# EasyEDA Pro project MSDR_EzEdaPro.eprj, schematic Schematic1_1
Create Date: 2024-09-13; Page Name: P1; Project Name: MSDR_EzEdaPro; Schematic Name: Schematic1_1; Update Date: 2024-09-13; Company: EasyEDA.com; Drawn: EasyEDA; Page Size: A4; Part Number: JLCPCB-002; Reviewed: EasyEDA; Version: V0.1
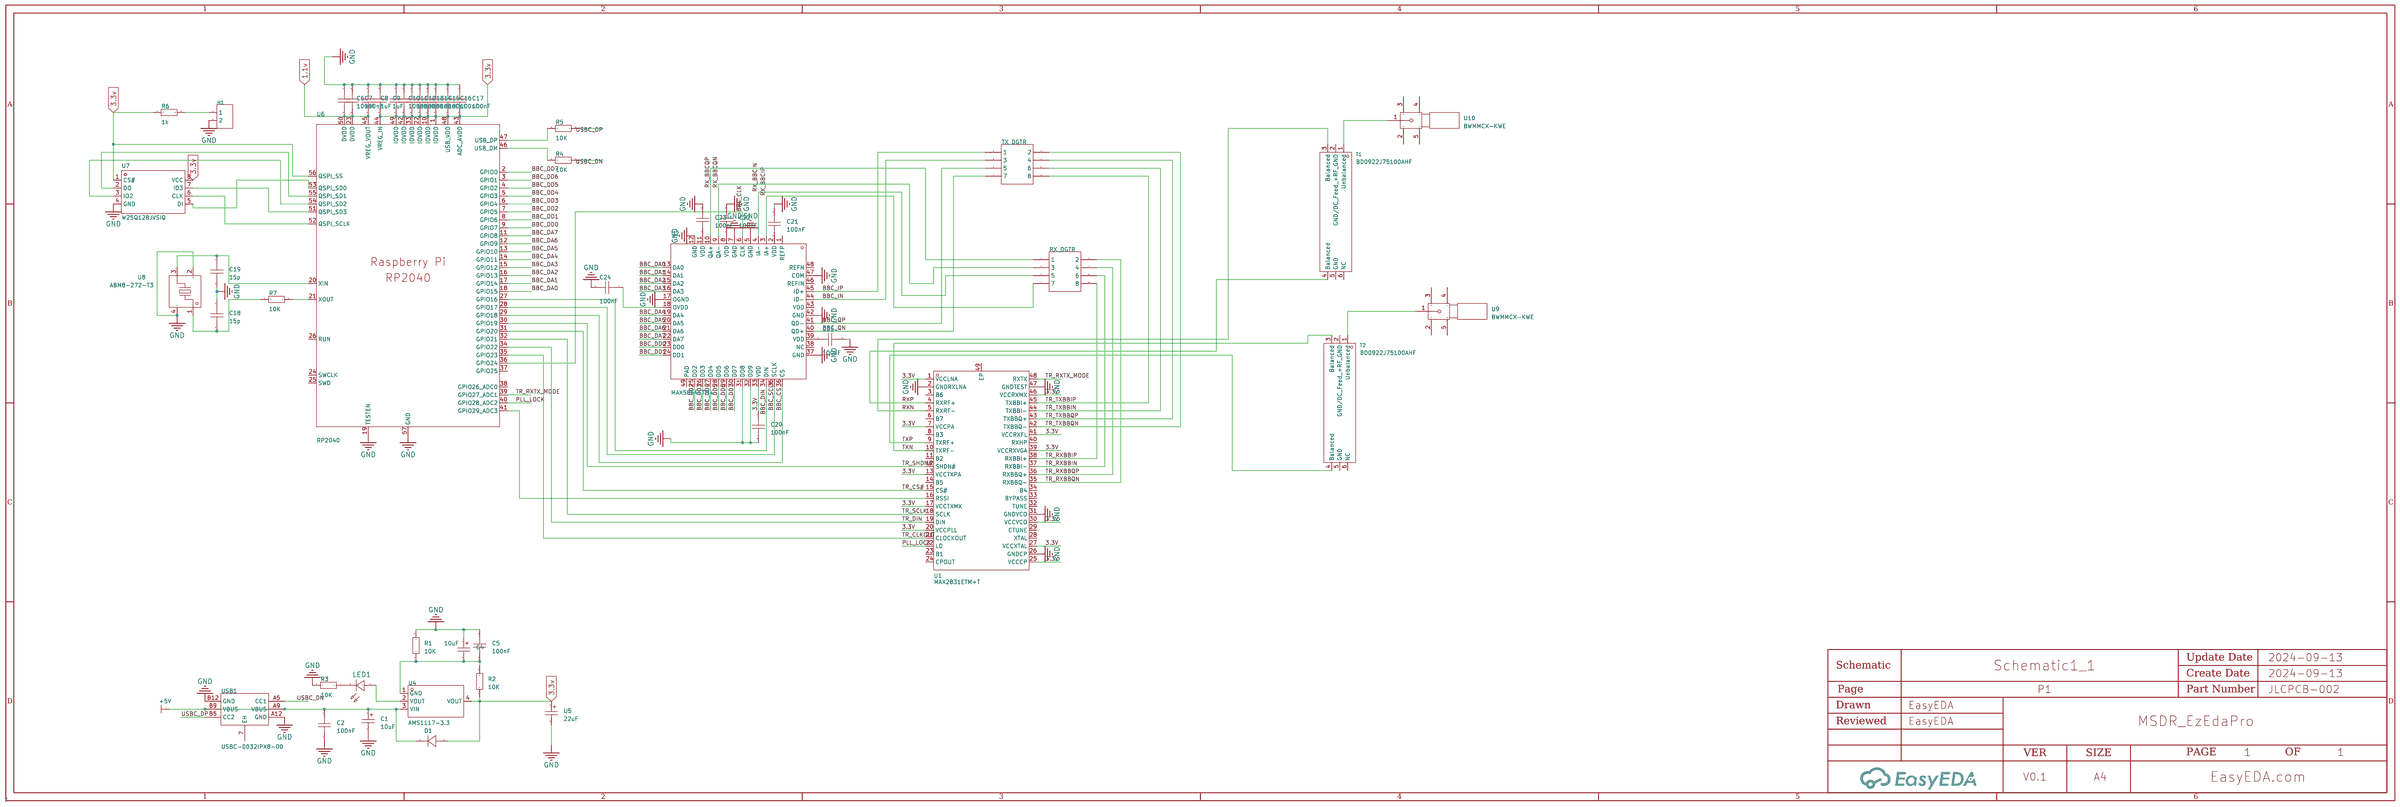
[diagram p0: schematic sheet]

## Parts
C1  10uF  [CAP-SMD_BD3.0-L3.3-W3.3-RD]
C2  100nF  [C0805]
C4  10uF  [CAP-SMD_BD3.0-L3.3-W3.3-RD]
C5  100nF  [C0805]
C6  100nF  [C0402]
C7  100nF  [C0402]
C8  1uF  [C0402]
C9  1uF  [C0402]
C10  100nF  [C0402]
C11  100nF  [C0402]
C12  100nF  [C0402]
C13  100nF  [C0402]
C14  100nF  [C0402]
C15  100nF  [C0402]
C16  100nF  [C0402]
C17  100nF  [C0402]
C18  15p  [C0402]
C19  15p  [C0402]
C20  100nF  [C0201]
C21  100nF  [C0201]
C22  100nF  [C0201]
C23  100nF  [C0201]
C24  100nF  [C0201]
C25  100nF  [C0201]
D1  -  [SMA_L4.4-W2.8-LS5.4-RD]
H1  -  [HDR-TH_2P-P2.54-V-F]
LED1  -  [LED0805-RD_GREEN]
R1  10K  [R0603]
R2  10K  [R0603]
R3  10K  [R0603]
R4  10K  [R0402]
R5  10K  [R0402]
R6  1k  [R0402]
R7  10K  [R0402]
RX_DGTR  -  [HDR-TH_8P-P2.54-V-F-R2-C4-S2.54-1]
T1  BD0922J75100AHF  [XFMR-SMD_6P-L2.1-W1.3-P0.65-BL]
T2  BD0922J75100AHF  [XFMR-SMD_6P-L2.1-W1.3-P0.65-BL]
TX_DGTR  -  [HDR-TH_8P-P2.54-V-F-R2-C4-S2.54-1]
U1  MAX2831ETM+T  [TQFN-48_L7.0-W7.0-P0.50-TL-EP5.6]
U2  MAX5864ETM+  [QFN-48_L7.0-W7.0-P0.50-BL-EP5.1]
U4  AMS1117-3.3  [SOT-223-3_L6.5-W3.4-P2.30-LS7.0-BR]
U5  22uF  [CASE-B_3528]
U6  RP2040  [LQFN-56_L7.0-W7.0-P0.4-EP]
U7  W25Q128JVSIQ  [SOIC-8_L5.3-W5.3-P1.27-LS8.0-BL]
U8  ABM8-272-T3  [CRYSTAL-SMD_4P-L3.2-W2.5-BL]
U9  BWMMCX-KWE  [MMCX-TH_DL-MMCX-KWE]
U10  BWMMCX-KWE  [MMCX-TH_DL-MMCX-KWE]
USB1  USBC-0032IPX8-00  [TYPE-C-USB-SMD_USBC-0032IPX8-00]

## Library data of the parts
C1 C4 = C_Ele_SMD_3x5.4mm: Supplier Footprint: SMD,3x5.4mm
C2 C5 = CAP_0805: Supplier Footprint: 0805
C6-C19 = CAP_0402: Supplier Part: C1525; Supplier Footprint: 0402
C20-C25 = CAP_0201: Supplier Footprint: 0201
D1 = 1N4007: Supplier Footprint: SMA(DO-214AC); Supplier Part: C727081
H1 = HDR-F_2.54_1x2P: Supplier Footprint: Through
LED1 = LED_0805-R: Supplier Footprint: 0805
R1-R3 = Res_0603: Supplier Footprint: 0603
R4-R7 = Res_0402: Supplier Footprint: 0402
RX_DGTR TX_DGTR = HDR-F-2.54_2x4: Supplier Footprint: Through
T1 T2 = BD0922J75100AHF: Frequency Range:900MHz~2.2GHz Frequency Range:900MHz~2.2GHz Impedance Ratio-Unbalanced/Balanced:75Ω:100Ω Insertion Loss (Max):1.3dB Phase Balance:4° Return Loss (Min):12dB; Supplier Part: C502733; Manufacturer: Anaren(安伦); Supplier Footprint: 0805; JLCPCB Part Class: Extended Part; Datasheet: https://atta.szlcsc.com/upload/public/pdf/source/20200325/C502733_A6A72FA540C229E36F661D21F2A3F54B.pdf; Supplier: LCSC; Frequency Range: 900MHz~2.2GHz; Impedance Ratio-Unbalanced/Balanced: 75Ω:100Ω; Insertion Loss (Max): 1.3dB; Phase Balance: 4°; Return Loss (Min): 12dB
U1 = MAX2831ETM+T: Frequency Range:2.4GHz Frequency Range:2.4GHz Interface:SPI Operating Voltage:2.7V~3.6V Operating Voltage:2.7V~3.6V Applications:WiFi Output Power:21dBm Data Rate:54Mbps Current Of Transmitting:82mA Sensitivity:-76dBm Receive Current:62mA Operating Temper; Supplier Part: C2152047; Manufacturer: ADI(亚德诺)/MAXIM(美信); Supplier Footprint: TQFN-48-EP(7x7); JLCPCB Part Class: Extended Part; Datasheet: https://atta.szlcsc.com/upload/public/pdf/source/20210601/D5E13A4F591163B65DE03F91E5182685.pdf; Supplier: LCSC; Frequency Range: 2.4GHz; Interface: SPI; Operating Voltage: 2.7V~3.6V; Applications: WiFi; Output Power: 21dBm; Data Rate: 54Mbps; Current Of Transmitting: 82mA; Sensitivity: -76dBm; Receive Current: 62mA; Operating Temperature: -40℃~+85℃
U2 = MAX5864ETM+: Supply Voltage:2.7V~3.3V Supply Voltage:2.7V~3.3V; LCSC Part Name: MAX5864ETM; Supplier Part: C143525; Manufacturer: ADI(亚德诺)/MAXIM(美信); Supplier Footprint: QFN-48-EP(7x7); JLCPCB Part Class: Extended Part; Datasheet: https://atta.szlcsc.com/upload/public/pdf/source/20171204/C143525_15123772477351162683.pdf; Supplier: LCSC; Supply Voltage: 2.7V~3.3V
U4 = AMS1117-3.3_C6186: Output Type: Maximum Input Voltage:- Output Voltage:3.3V Output Voltage:3.3V MAX Output Current:1A Power Supply Rejection Ratio (PSRR):72dB@(120Hz) Dropout Voltage:1.3V@(800mA) standby current:- Noise:- Feature:- Operating Temperature:- Operating Temperat; LCSC Part Name: 输出3.3V 1A; Supplier Part: C6186; Manufacturer: AMS; Supplier Footprint: SOT-223; JLCPCB Part Class: Basic Part; Datasheet: https://atta.szlcsc.com/upload/public/pdf/source/20180727/C6186_7A095716F0823C02F1997A905E26C086.pdf; Supplier: LCSC; Output Voltage: 3.3V; MAX Output Current: 1A; Power Supply Rejection Ratio (PSRR): 72dB@(120Hz); Dropout Voltage: 1.3V@(800mA); Output Polarity: Positive electrode; Number of Outputs: 1
U5 = CA45-B-20V-22UF-M: Capacitance: Tolerance:±20% Tolerance:±20% Rated Voltage: Leakage Current(DCL):- Ripple Current:- Equivalent Series Resistance(ESR):-; LCSC Part Name: 22uF ±20% 20V; Supplier Part: C2837196; Manufacturer: CEC(振华新云); Supplier Footprint: CASE-B-3528; JLCPCB Part Class: Extended Part; Datasheet: https://atta.szlcsc.com/upload/public/pdf/source/20210531/C2837196_DDCE34066E9DA6377CD15749F6AD58AB.pdf; Supplier: LCSC; Tolerance: ±20%
U6 = RP2040_C2040: CPU Core:- RAM Size:264KB GPIO Ports Number:30 Operating Voltage Range:- Operating Voltage Range:- CPU Maximum Speed:133MHz Program Memory Type:- Operating Temperature Range:- Operating Temperature Range:- ADC (Bit):12bit DAC (Bit):- PWM (Bit):- 8Bit Time; LCSC Part Name: RP2040（RP2B2）; Supplier Part: C2040; Manufacturer: Raspberry Pi(树莓派); Supplier Footprint: LQFN-56(7x7); JLCPCB Part Class: Extended Part; Datasheet: https://atta.szlcsc.com/upload/public/pdf/source/20210621/C2040_96F425825606B7957D87DD32E2512CA9.pdf; Supplier: LCSC; RAM Size: 264KB; GPIO Ports Number: 30; CPU Maximum Speed: 133MHz; ADC (Bit): 12bit; UART/USART: 2; I2C: 2; SPI: 2; Universal Serial Bus: 有; Peripheral/Function: DMA；PWM; Direct Memory Access: 有
U7 = W25Q128JVSIQ: Interface Type:- Memory Size:128Mbit Clock Frequency (fc):- Supply Voltage:- Supply Voltage:- Supply Current (Read):- Supply Current (Program):- Supply Current (Erase):- Standby supply current:- Page Programming Time (Tpp):- Block Erase Time (tBE):- Data; LCSC Part Name: W25Q128JVSIQ 编带; Supplier Part: C97521; Manufacturer: WINBOND(华邦); Supplier Footprint: SOIC-8-208mil; JLCPCB Part Class: Basic Part; Datasheet: https://atta.szlcsc.com/upload/public/pdf/source/20170316/1489627409956.pdf; Supplier: LCSC; Memory Size: 128Mbit
U8 = ABM8-272-T3_C20625731: Supplier Part: C20625731; Manufacturer: ABRACON; Supplier Footprint: SMD3225-4P; JLCPCB Part Class: Extended Part; Datasheet: https://atta.szlcsc.com/upload/public/pdf/source/20240227/A8BE43F636D80F75C9AF5C59EDF21E9A.pdf; Supplier: LCSC
U9 U10 = BWMMCX-KWE: Connector Type:板端 Interface Type:内孔 Number of Ports:1 Interface Diameter:3.45mm Interface Length/Height:6.8mm Frequency-Max:6GHz RF Series:- Impedance:50Ω Style:弯头 Contact Material:- Contact Plating:- Operating Temperature Range:- Operating Temperature Ra; LCSC Part Name: 内孔 弯头; Supplier Part: C5137199; Manufacturer: BAT WIRELESS(蝙蝠无线); Supplier Footprint: 插件; JLCPCB Part Class: Extended Part; Datasheet: https://atta.szlcsc.com/upload/public/pdf/source/20230721/A5C4EBF049B4E6F2F5E4EE0CA658130D.pdf; Supplier: LCSC; Connector Type: 板端; Interface Type: 内孔; Number of Ports: 1; Interface Diameter: 3.45mm; Interface Length/Height: 6.8mm; Frequency-Max: 6GHz; Impedance: 50Ω; Style: 弯头
USB1 = USBC-0032IPX8-00: Connector Type:Type-C Standard:USB 3.1 Gender:Female Mounting Style:Horizontal attachment Number of Contacts:6P Number of Ports:1 Current Rating - Power (Max):3A Operating Temperature Range:-30℃~+85℃ Operating Temperature Range:-30℃~+85℃ Connect-Disconnec; LCSC Part Name: Type-C 母 卧贴 两件套; Supplier Part: C783299; Manufacturer: SHOU HAN(首韩); Supplier Footprint: SMD; JLCPCB Part Class: Extended Part; Datasheet: https://atta.szlcsc.com/upload/public/pdf/source/20200915/C783299_CEA99EAD24A7AFC4E6DA6639D9ED2813.pdf; Supplier: LCSC; Connector Type: Type-C; Standard: USB 3.1; Gender: Female; Mounting Style: Horizontal attachment; Number of Contacts: 6P; Number of Ports: 1; Current Rating - Power (Max): 3A; Operating Temperature Range: -30℃~+85℃; Connect-Disconnect Life: 10,000 times; Core Colour: Black

## Nets
1.1v: C6.2 C7.2 C8.2 U6.23(DVDD) U6.45(VREG_VOUT) U6.50(DVDD)
3.3V: C20.1 U1.1(VCCLNA) U1.7(VCCPA) U1.13(VCCTXPA) U1.17(VCCTXMX) U1.20(VCCPLL) U1.25(VCCCP) U1.27(VCCXTAL) U1.30(VCCVCO) U1.39(VCCRXVGA) U1.41(VCCRXFL) U1.46(VCCRXMX) U2.33(VDD)
3.3v: C9.2 C10.2 C11.2 C12.2 C13.2 C14.2 C15.2 C16.2 C17.2 D1.2(A) R2.1 R6.1 U4.4(VOUT) U5.1 U6.1(IOVDD) U6.10(IOVDD) U6.22(IOVDD) U6.33(IOVDD) U6.42(IOVDD) U6.43(ADC_AVDD) U6.44(VREG_IN) U6.48(USB_VDD) U6.49(IOVDD) U6.56(QSPI_SS) U7.1(CS#) U7.8(VCC)
+5V: C1.1 C2.1 D1.1(K) U4.3(VIN) USB1.A9(VBUS) USB1.B9(VBUS)
GND: C1.2 C2.2 C4.1 C5.1 C6.1 C7.1 C8.1 C9.1 C10.1 C11.1 C12.1 C13.1 C14.1 C15.1 C16.1 C17.1 C18.1 C19.2 C20.2 C21.2 C22.2 C23.2 C24.2 C25.2 H1.2 R1.2 R3.2 U1.2(GNDRXLNA) U1.26(GNDCP) U1.31(GNDVCO) U1.47(GNDTEST) U2.5(GND) U2.7(GND) U2.12(GND) U2.17(OGND) U2.31(DD8) U2.32(DD9) U2.37(GND) U2.42(GND) U2.47(COM) U5.2 U6.19(TESTEN) U6.57(GND) U7.4(GND) U8.2(GND) U8.4(GND) USB1.A12(GND) USB1.B12(GND)
BBC_CLK: U2.6(CLK) U6.36(GPIO24)
BBC_CS: U2.36(CS) U6.29(GPIO18)
BBC_DA0: U2.13(DA0) U6.18(GPIO15)
BBC_DA1: U2.14(DA1) U6.17(GPIO14)
BBC_DA2: U2.15(DA2) U6.16(GPIO13)
BBC_DA3: U2.16(DA3) U6.15(GPIO12)
BBC_DA4: U2.19(DA4) U6.14(GPIO11)
BBC_DA5: U2.20(DA5) U6.13(GPIO10)
BBC_DA6: U2.21(DA6) U6.12(GPIO9)
BBC_DA7: U2.22(DA7) U6.11(GPIO8)
BBC_DD0: U2.23(DD0) U6.9(GPIO7)
BBC_DD1: U2.24(DD1) U6.8(GPIO6)
BBC_DD2: U2.25(DD2) U6.7(GPIO5)
BBC_DD3: U2.26(DD3) U6.6(GPIO4)
BBC_DD4: U2.27(DD4) U6.5(GPIO3)
BBC_DD5: U2.28(DD5) U6.4(GPIO2)
BBC_DD6: U2.29(DD6) U6.3(GPIO1)
BBC_DD7: U2.30(DD7) U6.2(GPIO0)
BBC_DIN: U2.34(DIN) U6.27(GPIO16)
BBC_IN: TX_DGTR.3 U2.44(ID-)
BBC_IP: TX_DGTR.1 U2.45(ID+)
BBC_QN: TX_DGTR.7 U2.40(QD+)
BBC_QP: TX_DGTR.5 U2.41(QD-)
BBC_SCLK: U2.35(SCLK) U6.28(GPIO17)
PLL_LOCK: U1.22(LD) U6.40(GPIO28_ADC2)
RX_BBCIN: RX_DGTR.5 U2.4(IA-)
RX_BBCIP: RX_DGTR.7 U2.3(IA+)
RX_BBCQN: RX_DGTR.3 U2.9(QA-)
RX_BBCQP: RX_DGTR.1 U2.10(QA+)
RXN: T1.3(Balanced) U1.5(RXRF-)
RXP: T1.4(Balanced) U1.4(RXRF+)
TR_CLKOUT: U1.21(CLOCKOUT) U6.35(GPIO23)
TR_CS#: U1.15(CS#) U6.31(GPIO20)
TR_DIN: U1.19(DIN) U6.34(GPIO22)
TR_RXBBIN: RX_DGTR.6 U1.37(RXBBI-)
TR_RXBBIP: RX_DGTR.8 U1.38(RXBBI+)
TR_RXBBQN: RX_DGTR.2 U1.35(RXBBQ-)
TR_RXBBQP: RX_DGTR.4 U1.36(RXBBQ+)
TR_RXTX_MODE: U1.48(RXTX) U6.39(GPIO27_ADC1)
TR_SCLK: U1.18(SCLK) U6.32(GPIO21)
TR_SHDN#: U1.12(SHDN#) U6.30(GPIO19)
TR_TXBBIN: TX_DGTR.6 U1.44(TXBBI-)
TR_TXBBIP: TX_DGTR.8 U1.45(TXBBI+)
TR_TXBBQN: TX_DGTR.2 U1.42(TXBBQ-)
TR_TXBBQP: TX_DGTR.4 U1.43(TXBBQ+)
TXN: T2.3(Balanced) U1.10(TXRF-)
TXP: T2.4(Balanced) U1.9(TXRF+)
USBC_DN: R4.1 USB1.A5(CC1)
USBC_DP: R5.1 USB1.B5(CC2)
$1N1972: LED1.1(A) U4.2(VOUT)
$1N2144: C4.2 C5.2 R1.1 R2.2 U4.1(GND)
$1N2960: LED1.2(C) R3.1
$1N3442: R5.2 U6.47(USB_DP)
$1N3446: R4.2 U6.46(USB_DM)
$1N5034: U6.51(QSPI_SD3) U7.7(IO3)
$1N5044: U6.54(QSPI_SD2) U7.3(IO2)
$1N5058: U6.53(QSPI_SD0) U7.5(DI)
$1N5070: U6.55(QSPI_SD1) U7.2(DO)
$1N5085: U6.52(QSPI_SCLK) U7.6(CLK)
$1N5173: H1.1 R6.2
$1N5390: C19.1 U6.20(XIN) U8.3
$1N5565: C18.2 R7.1 U8.1
$1N5572: R7.2 U6.21(XOUT)
$1N7470: C21.1 U2.2(VDD)
$1N7508: C22.1 U2.8(VDD)
$1N7546: C23.1 U2.11(VDD)
$1N7584: C24.1 U2.18(OVDD)
$1N7821: C25.1 U2.39(VDD)
$1N12568: U1.16(RSSI) U6.41(GPIO29_ADC3)
$1N12907: T2.1(Unbalanced) U9.1
$1N12914: T1.1(Unbalanced) U10.1

Not connected (* = marked no-connect by the designer): T1 2(GND/DC Feed +RF GND) 5(GND) 6(NC); T2 2(GND/DC Feed +RF GND) 5(GND) 6(NC); U1 3(B6) 6(B7) 8(B3) 11(B2) 14(B5) 23(B1) 24(CPOUT) 28(XTAL) 29(CTUNE) 32(TUNE) 33(BYPASS) 34(B4) 40(RXHP) 49(EP); U2 1(REFP) 38(NC) 43(VDD) 46(REFIN) 48(REFN) 49(PAD); U6 24(SWCLK) 25(SWD) 26(RUN) 37(GPIO25) 38(GPIO26_ADC0); U9 2 3 4 5; U10 2 3 4 5; USB1 7(EH)
